# EAGLE design STM32F767ZI_eval_0 (EAGLE 7.7.0)

## Sheet 1 of 3
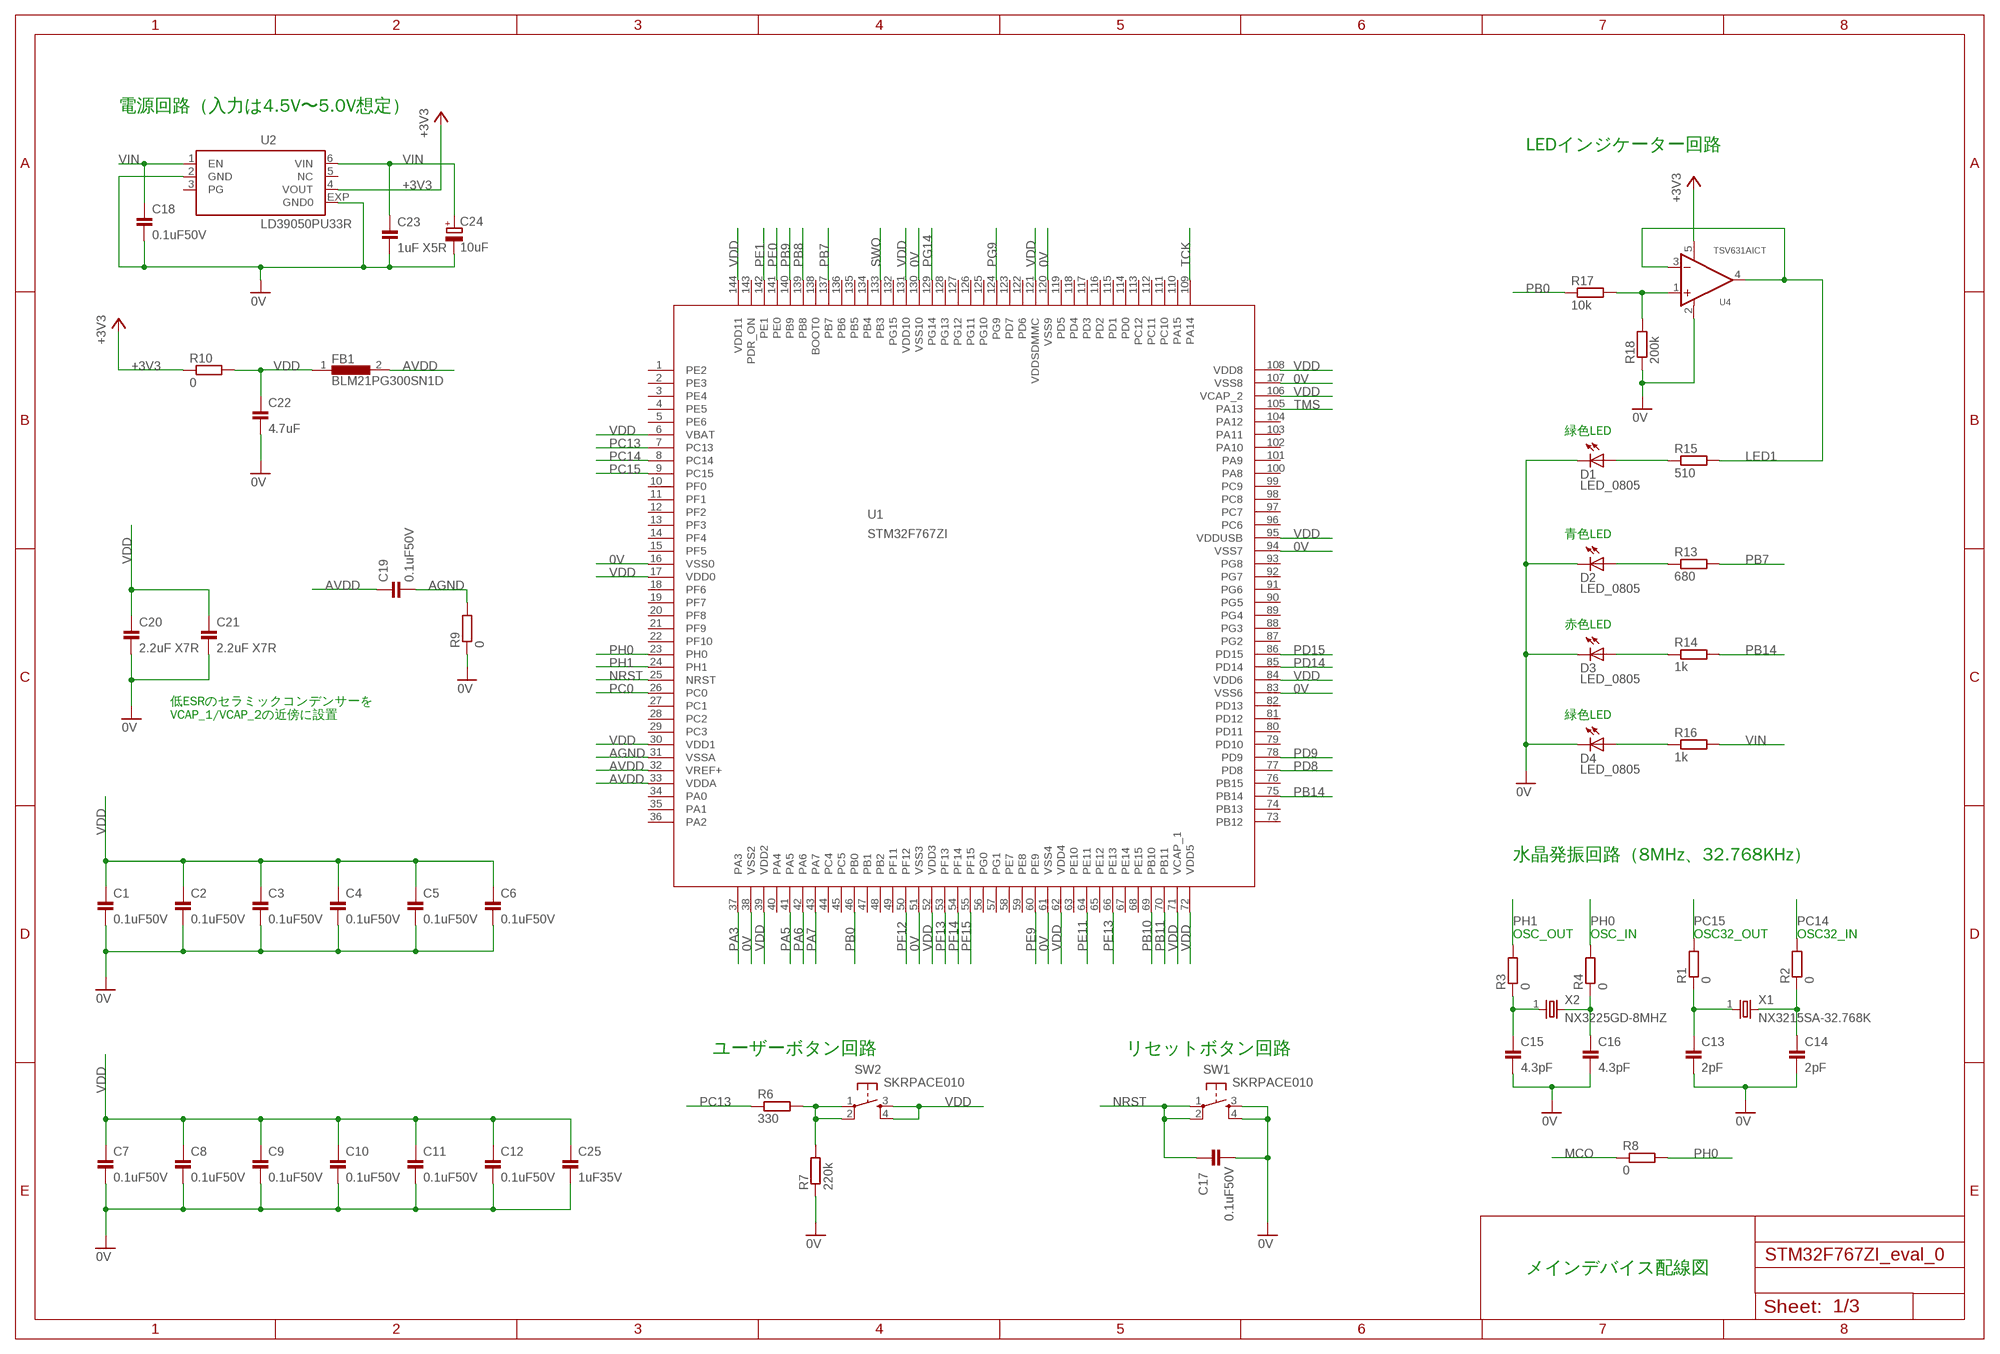
[diagram p0: schematic, sheet 1]

### Parts
C1  0.1uF50V  CAP_0603_DEV  [SMD_1608_DEV]
C2  0.1uF50V  CAP_0603_DEV  [SMD_1608_DEV]
C3  0.1uF50V  CAP_0603_DEV  [SMD_1608_DEV]
C4  0.1uF50V  CAP_0603_DEV  [SMD_1608_DEV]
C5  0.1uF50V  CAP_0603_DEV  [SMD_1608_DEV]
C6  0.1uF50V  CAP_0603_DEV  [SMD_1608_DEV]
C7  0.1uF50V  CAP_0603_DEV  [SMD_1608_DEV]
C8  0.1uF50V  CAP_0603_DEV  [SMD_1608_DEV]
C9  0.1uF50V  CAP_0603_DEV  [SMD_1608_DEV]
C10  0.1uF50V  CAP_0603_DEV  [SMD_1608_DEV]
C11  0.1uF50V  CAP_0603_DEV  [SMD_1608_DEV]
C12  0.1uF50V  CAP_0603_DEV  [SMD_1608_DEV]
C13  2pF  CAP_0603_DEV  [SMD_1608_DEV]
C14  2pF  CAP_0603_DEV  [SMD_1608_DEV]
C15  4.3pF  CAP_0603_DEV  [SMD_1608_DEV]
C16  4.3pF  CAP_0603_DEV  [SMD_1608_DEV]
C17  0.1uF50V  CAP_0603_DEV  [SMD_1608_DEV]
C18  0.1uF50V  CAP_0603_DEV  [SMD_1608_DEV]
C19  0.1uF50V  CAP_0603_DEV  [SMD_1608_DEV]
C20  2.2uF X7R  CAP_0603_DEV  [SMD_1608_DEV]
C21  2.2uF X7R  CAP_0603_DEV  [SMD_1608_DEV]
C22  4.7uF  CAP_0603_DEV  [SMD_1608_DEV]
C23  1uF X5R  CAP_0603_DEV  [SMD_1608_DEV]
C24  10uF  TPST106K016R0800_  [C1210_TPST_DEV]
C25  1uF35V  CAP_0603_DEV  [SMD_1608_DEV]
D1  LED_0805  [CHIPLED_0805]
D2  LED_0805  [CHIPLED_0805]
D3  LED_0805  [CHIPLED_0805]
D4  LED_0805  [CHIPLED_0805]
FB1  BLM21PG300SN1D  [SMD_2012_DEV]
R1  0  RESISTOR_0603_DEV  [SMD_1608_DEV]
R2  0  RESISTOR_0603_DEV  [SMD_1608_DEV]
R3  0  RESISTOR_0603_DEV  [SMD_1608_DEV]
R4  0  RESISTOR_0603_DEV  [SMD_1608_DEV]
R6  330  RESISTOR_0603_DEV  [SMD_1608_DEV]
R7  220k  RESISTOR_0603_DEV  [SMD_1608_DEV]
R8  0  RESISTOR_0603_DEV  [SMD_1608_DEV]
R9  0  RESISTOR_0603_DEV  [SMD_1608_DEV]
R10  0  RESISTOR_0603_DEV  [SMD_1608_DEV]
R13  680  RESISTOR_0603_DEV  [SMD_1608_DEV]
R14  1k  RESISTOR_0603_DEV  [SMD_1608_DEV]
R15  510  RESISTOR_0603_DEV  [SMD_1608_DEV]
R16  1k  RESISTOR_0603_DEV  [SMD_1608_DEV]
R17  10k  RESISTOR_0603_DEV  [SMD_1608_DEV]
R18  200k  RESISTOR_0603_DEV  [SMD_1608_DEV]
SW1  SKRPACE010  [SKRPACE010]
SW2  SKRPACE010  [SKRPACE010]
U1  STM32F767ZI  [LQFP144]
U2  LD39050PU33R  [DFN6-3X3]
U4  TSV631AICT  [SC-70-5]
X1  NX3215SA-32.768K  [NX3215]
X2  NX3225GD-8MHZ  [NX3225]

### Nets
0V: C1.2 C2.2 C3.2 C4.2 C5.2 C6.2 C7.2 C8.2 C9.2 C10.2 C11.2 C12.2 C13.2 C14.2 C15.2 C16.2 C17.2 C18.2 C20.2 C21.2 C22.2 C23.2 C24.2(-) C25.2 D1.C D2.C D3.C D4.C R7.1 R9.1 R18.1 SW1.3(S) SW1.4(S1) U1.16(VSS0) U1.38(VSS2) U1.51(VSS3) U1.61(VSS4) U1.83(VSS6) U1.94(VSS7) U1.107(VSS8) U1.120(VSS9) U1.130(VSS10) U2.2(GND) U2.EXP(GND0) U4.2(V-) ; also sheet 2,3
+3V3: R10.1 U2.4(VOUT) U4.5(V+) ; also sheet 2
AGND: C19.2 R9.2 U1.31(VSSA) ; also sheet 2
AVDD: C19.1 FB1.2 U1.32(VREF+) U1.33(VDDA) ; also sheet 2
LED1: R15.2 U4.3(IN-) U4.4(OUT)
MCO: R8.1
N$1: C15.1 R3.1 X2.1
N$2: C14.1 R2.1 X1.2
N$3: C13.1 R1.1 X1.1
N$4: D2.A R13.1
N$5: C16.1 R4.1 X2.2
N$6: R6.2 R7.2 SW2.1(P) SW2.2(P1)
N$7: D3.A R14.1
N$9: R17.2 R18.2 U4.1(IN+)
N$10: D1.A R15.1
N$11: D4.A R16.1
NRST: C17.1 SW1.1(P) SW1.2(P1) U1.25(NRST) ; also sheet 2,3
PA3: U1.37(PA3) ; also sheet 2
PA5: U1.41(PA5) ; also sheet 2
PA6: U1.42(PA6) ; also sheet 2
PA7: U1.43(PA7) ; also sheet 2
PB0: R17.1 U1.46(PB0)
PB7: R13.2 U1.137(PB7)
PB8: U1.139(PB8) ; also sheet 2
PB9: U1.140(PB9) ; also sheet 2
PB10: U1.69(PB10) ; also sheet 3
PB11: U1.70(PB11) ; also sheet 3
PB14: R14.2 U1.75(PB14)
PC0: U1.26(PC0) ; also sheet 2
PC13: R6.1 U1.7(PC13)
PC14: R2.2 U1.8(PC14)
PC15: R1.2 U1.9(PC15)
PD8: U1.77(PD8) ; also sheet 2
PD9: U1.78(PD9) ; also sheet 2
PD14: U1.85(PD14) ; also sheet 2
PD15: U1.86(PD15) ; also sheet 2
PE0: U1.141(PE0)
PE1: U1.142(PE1)
PE9: U1.60(PE9) ; also sheet 2
PE11: U1.64(PE11) ; also sheet 2
PE13: U1.66(PE13) ; also sheet 2
PF12: U1.50(PF12) ; also sheet 2
PF13: U1.53(PF13) ; also sheet 2
PF14: U1.54(PF14) ; also sheet 2
PF15: U1.55(PF15) ; also sheet 2
PG9: U1.124(PG9) ; also sheet 2
PG14: U1.129(PG14) ; also sheet 2
PH0: R4.2 R8.2 U1.23(PH0)
PH1: R3.2 U1.24(PH1)
SWO: U1.133(PB3) ; also sheet 2
TCK: U1.109(PA14) ; also sheet 2
TMS: U1.105(PA13) ; also sheet 2
VDD: C1.1 C2.1 C3.1 C4.1 C5.1 C6.1 C7.1 C8.1 C9.1 C10.1 C11.1 C12.1 C20.1 C21.1 C22.1 C25.1 FB1.1 R10.2 SW2.3(S) SW2.4(S1) U1.6(VBAT) U1.17(VDD0) U1.30(VDD1) U1.39(VDD2) U1.52(VDD3) U1.62(VDD4) U1.71(VCAP_1) U1.72(VDD5) U1.84(VDD6) U1.95(VDDUSB) U1.106(VCAP_2) U1.108(VDD8) U1.121(VDDSDMMC) U1.131(VDD10) U1.144(VDD11) ; also sheet 2,3
VIN: C18.1 C23.1 C24.1(+) R16.2 U2.1(EN) U2.6(VIN) ; also sheet 2
Unconnected: U1.1(PE2) U1.2(PE3) U1.3(PE4) U1.4(PE5) U1.5(PE6) U1.10(PF0) U1.11(PF1) U1.12(PF2) U1.13(PF3) U1.14(PF4) U1.15(PF5) U1.18(PF6) U1.19(PF7) U1.20(PF8) U1.21(PF9) U1.22(PF10) U1.27(PC1) U1.28(PC2) U1.29(PC3) U1.34(PA0) U1.35(PA1) U1.36(PA2) U1.40(PA4) U1.44(PC4) U1.45(PC5) U1.47(PB1) U1.48(PB2) U1.49(PF11) U1.56(PG0) U1.57(PG1) U1.58(PE7) U1.59(PE8) U1.63(PE10) U1.65(PE12) U1.67(PE14) U1.68(PE15) U1.73(PB12) U1.74(PB13) U1.76(PB15) U1.79(PD10) U1.80(PD11) U1.81(PD12) U1.82(PD13) U1.87(PG2) U1.88(PG3) U1.89(PG4) U1.90(PG5) U1.91(PG6) U1.92(PG7) U1.93(PG8) U1.96(PC6) U1.97(PC7) U1.98(PC8) U1.99(PC9) U1.100(PA8) U1.101(PA9) U1.102(PA10) U1.103(PA11) U1.104(PA12) U1.110(PA15) U1.111(PC10) U1.112(PC11) U1.113(PC12) U1.114(PD0) U1.115(PD1) U1.116(PD2) U1.117(PD3) U1.118(PD4) U1.119(PD5) U1.122(PD6) U1.123(PD7) U1.125(PG10) U1.126(PG11) U1.127(PG12) U1.128(PG13) U1.132(PG15) U1.134(PB4) U1.135(PB5) U1.136(PB6) U1.138(BOOT0) U1.143(PDR_ON) U2.3(PG) U2.5(NC)

### Notes on the sheet
- 電源回路（入力は4.5V〜5.0V想定）
- LEDインジケーター回路
- 緑色LED
- 青色LED
- 赤色LED
- 低ESRのセラミックコンデンサーを
  VCAP_1/VCAP_2の近傍に設置
- 緑色LED
- 水晶発振回路（8MHz、32.768KHz）
- OSC_OUT | OSC_IN | OSC32_OUT | OSC32_IN
- ユーザーボタン回路 | リセットボタン回路
- メインデバイス配線図

## Sheet 2 of 3
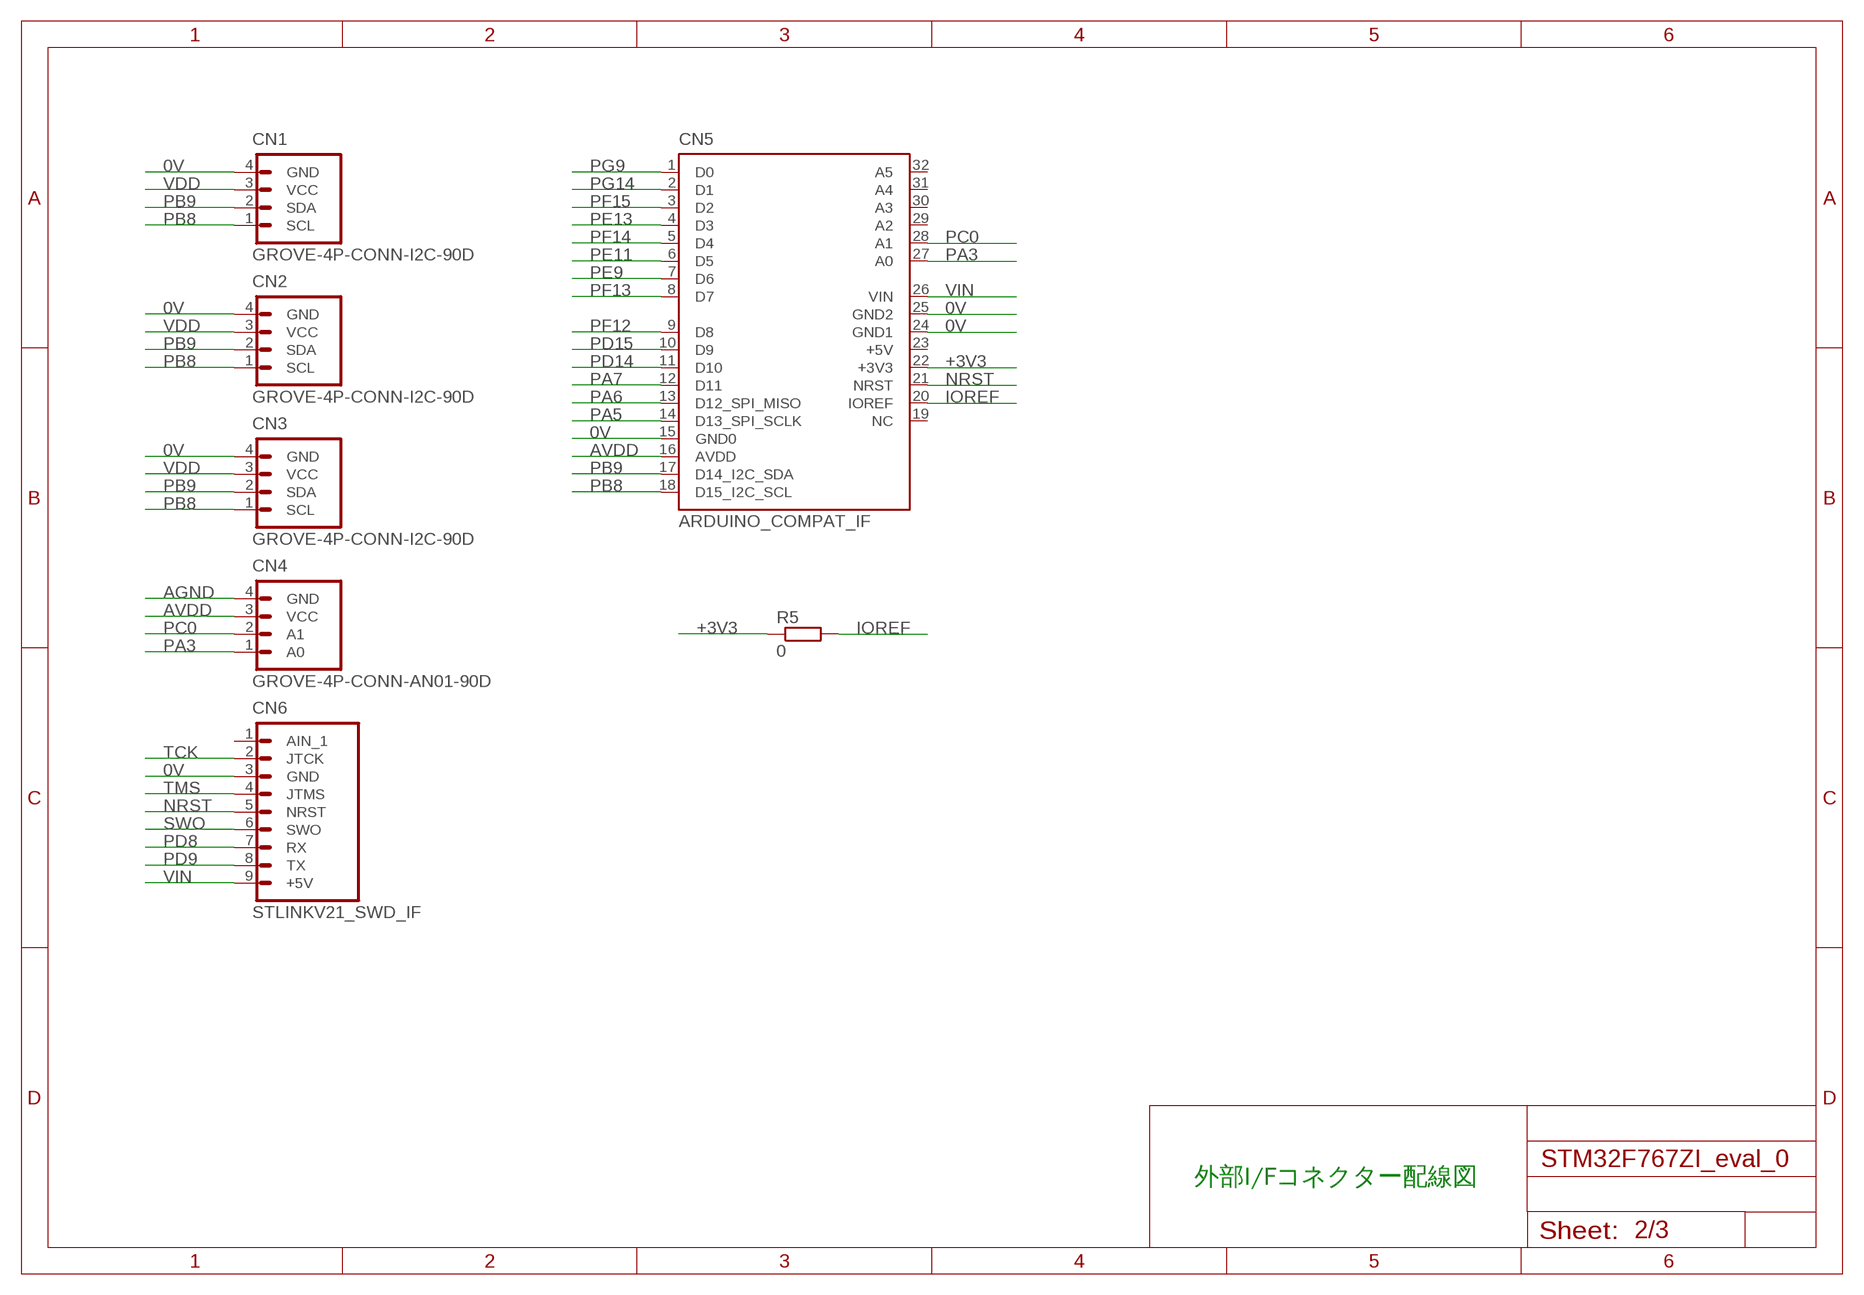
[diagram p1: schematic, sheet 2]

### Parts
CN1  GROVE-4P-CONN-I2C-90D  [GROVE-4P-90D]
CN2  GROVE-4P-CONN-I2C-90D  [GROVE-4P-90D]
CN3  GROVE-4P-CONN-I2C-90D  [GROVE-4P-90D]
CN4  GROVE-4P-CONN-AN01-90D  [GROVE-4P-90D]
CN5  ARDUINO_COMPAT_IF  [ARDUINO_COMPAT_IF]
CN6  STLINKV21_SWD_IF  [STLINKV21_SWD_H6]
R5  0  RESISTOR_0603_DEV  [SMD_1608_DEV]

### Nets
0V: CN1.4(GND) CN2.4(GND) CN3.4(GND) CN5.15(GND0) CN5.24(GND1) CN5.25(GND2) CN6.3(GND) ; also sheet 1,3
+3V3: CN5.22(+3V3) R5.1 ; also sheet 1
AGND: CN4.4(GND) ; also sheet 1
AVDD: CN4.3(VCC) CN5.16(AVDD) ; also sheet 1
IOREF: CN5.20(IOREF) R5.2
NRST: CN5.21(NRST) CN6.5(NRST) ; also sheet 1,3
PA3: CN4.1(A0) CN5.27(A0) ; also sheet 1
PA5: CN5.14(D13_SPI_SCLK) ; also sheet 1
PA6: CN5.13(D12_SPI_MISO) ; also sheet 1
PA7: CN5.12(D11) ; also sheet 1
PB8: CN1.1(SCL) CN2.1(SCL) CN3.1(SCL) CN5.18(D15_I2C_SCL) ; also sheet 1
PB9: CN1.2(SDA) CN2.2(SDA) CN3.2(SDA) CN5.17(D14_I2C_SDA) ; also sheet 1
PC0: CN4.2(A1) CN5.28(A1) ; also sheet 1
PD8: CN6.7(RX) ; also sheet 1
PD9: CN6.8(TX) ; also sheet 1
PD14: CN5.11(D10) ; also sheet 1
PD15: CN5.10(D9) ; also sheet 1
PE9: CN5.7(D6) ; also sheet 1
PE11: CN5.6(D5) ; also sheet 1
PE13: CN5.4(D3) ; also sheet 1
PF12: CN5.9(D8) ; also sheet 1
PF13: CN5.8(D7) ; also sheet 1
PF14: CN5.5(D4) ; also sheet 1
PF15: CN5.3(D2) ; also sheet 1
PG9: CN5.1(D0) ; also sheet 1
PG14: CN5.2(D1) ; also sheet 1
SWO: CN6.6(SWO) ; also sheet 1
TCK: CN6.2(JTCK) ; also sheet 1
TMS: CN6.4(JTMS) ; also sheet 1
VDD: CN1.3(VCC) CN2.3(VCC) CN3.3(VCC) ; also sheet 1,3
VIN: CN5.26(VIN) CN6.9(+5V) ; also sheet 1
Unconnected: CN5.19(NC) CN5.23(+5V) CN5.29(A2) CN5.30(A3) CN5.31(A4) CN5.32(A5) CN6.1(AIN_1)

### Notes on the sheet
- 外部I/Fコネクター配線図

## Sheet 3 of 3
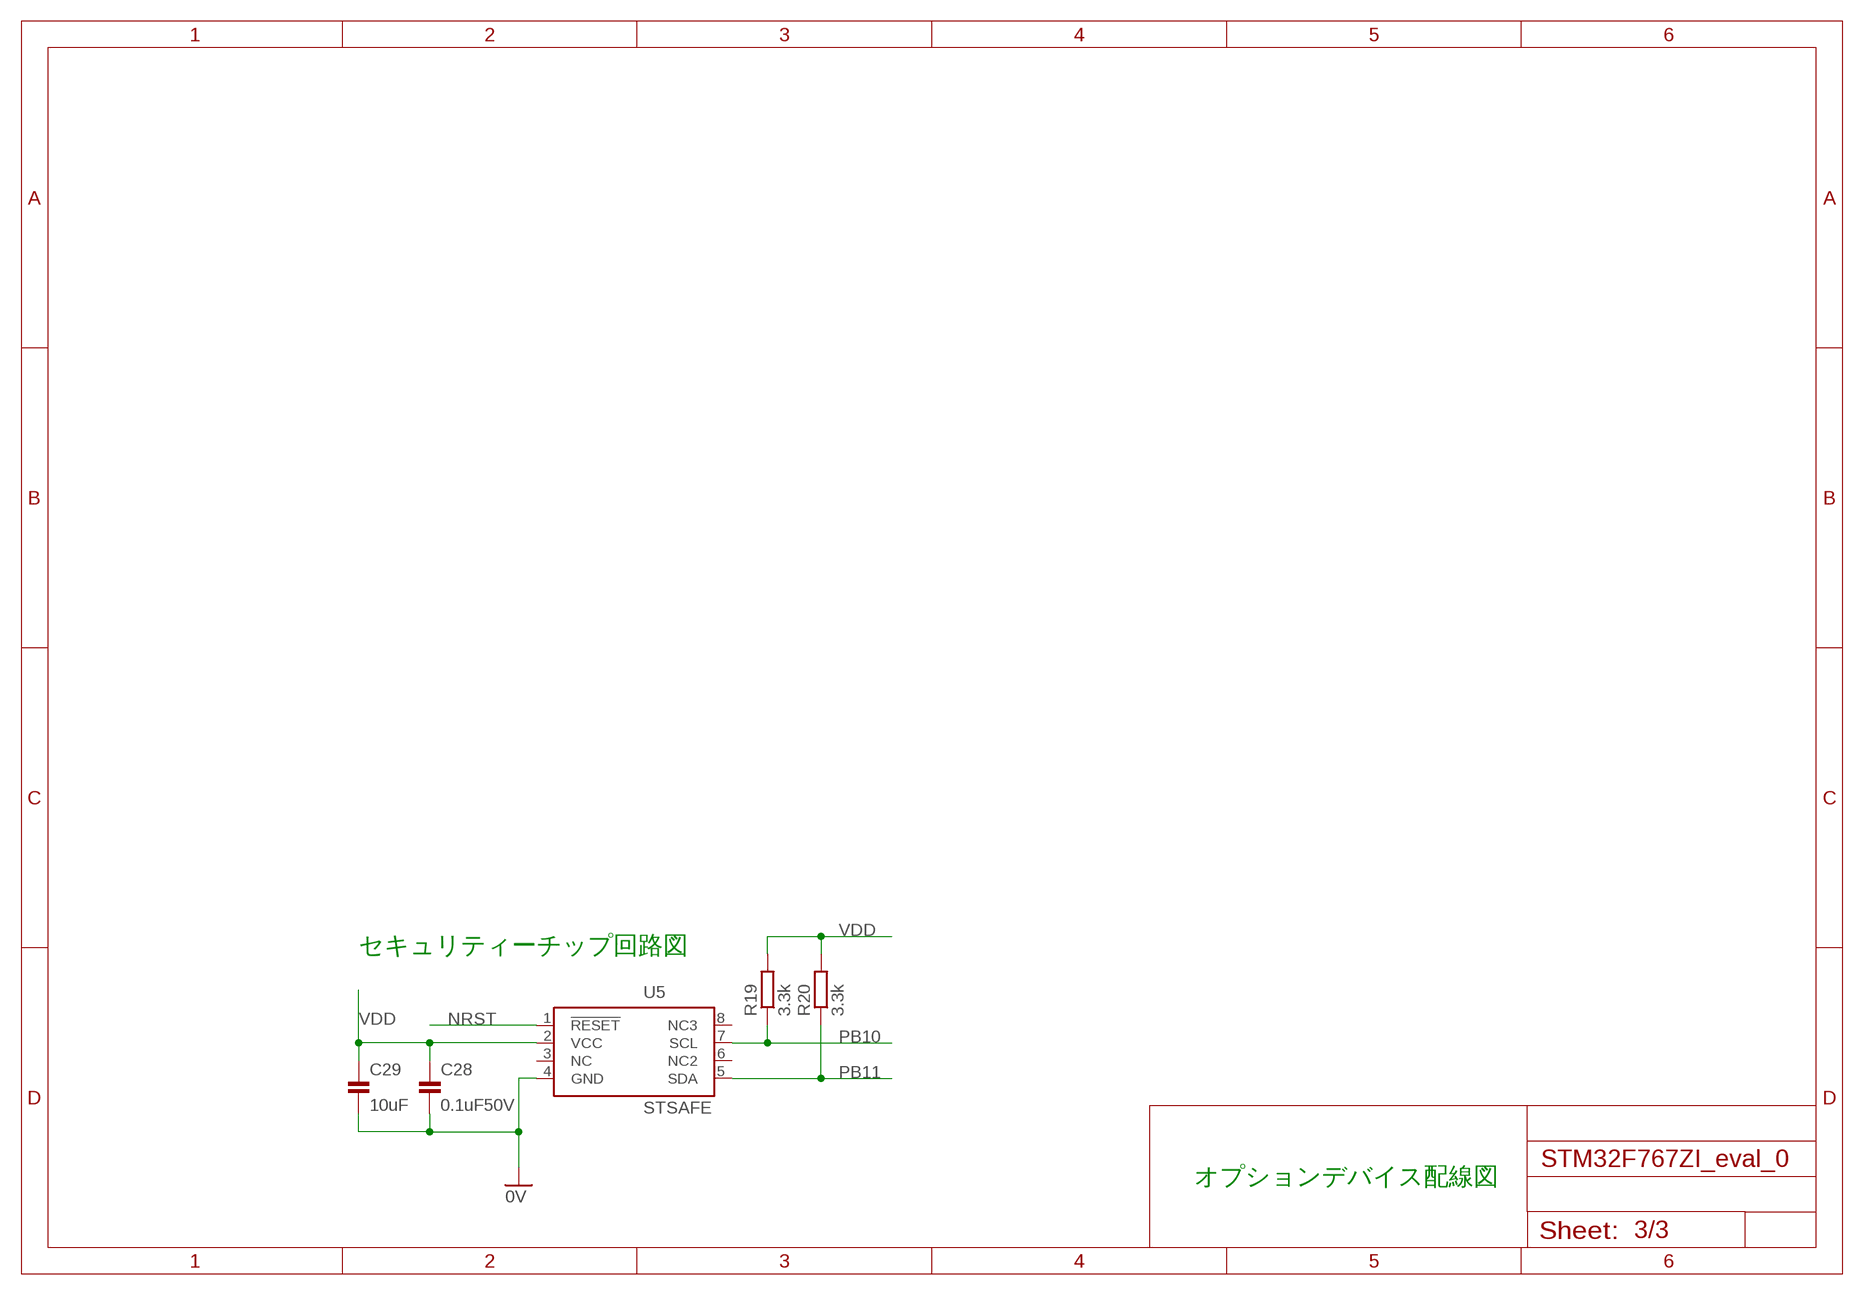
[diagram p2: schematic, sheet 3]

### Parts
C28  0.1uF50V  CAP_0603_DEV  [SMD_1608_DEV]
C29  10uF  CAP_0805_DEV  [SMD_2012_DEV]
R19  3.3k  RESISTOR_0603_DEV  [SMD_1608_DEV]
R20  3.3k  RESISTOR_0603_DEV  [SMD_1608_DEV]
U5  STSAFE  [SO8]

### Nets
0V: C28.2 C29.2 U5.4(GND) ; also sheet 1,2
NRST: U5.1(!RESET!) ; also sheet 1,2
PB10: R19.1 U5.7(SCL) ; also sheet 1
PB11: R20.1 U5.5(SDA) ; also sheet 1
VDD: C28.1 C29.1 R19.2 R20.2 U5.2(VCC) ; also sheet 1,2
Unconnected: U5.3(NC) U5.6(NC2) U5.8(NC3)

### Notes on the sheet
- セキュリティーチップ回路図
- オプションデバイス配線図

## Library data of the parts
C1-C23 C25 C28 C29 = Parts:CAP: コンデンサー
C24 = Parts:TPST*: タンタルコンデンサ TPST106K016R0800 10µF ±10% 16V ESR（等価直列抵抗）: 0.8オーム 動作温度 : -55°C～125°C サイズ : 3.50mm x 2.80mm
CN1-CN3 = PartsForProto:GROVE-4P-CONN-I2C: GROVE 4ピンコネクタ（I2C）
CN4 = PartsForProto:GROVE-4P-CONN-AN01: GROVE 4ピンコネクタ（ANALOG A0/A1）
CN5 = PartsForProto:ARDUINO_COMPAT_IF: Arduino互換ピンインターフェース
CN6 = PartsForProto:STLINKV21_SWD_IF: ST-LINK V2-1用 SWDインターフェース #1-#6は、NUCLEO-F767ZI付属のST-LINK V2-1上のCN6と接続 #7,#8は、NUCLEO-F767ZI付属のST-LINK V2-1上のCN5と接続 #9は、+5Vを別途供給（またはNUCLEOのJP3と接続）
D1-D4 = Parts:LED: 発光ダイオード
FB1 = Parts:BLM21PG: フェライトビーズ EMIFIL® 周波数あたりのインピーダンス : 30オーム @ 100MHz 電流定格（最大） : 4A DC抵抗（DCR）（最大）: 14ミリオーム 動作温度 : -55°C～125°C
R1-R10 R13-R20 = Parts:RESISTOR: 抵抗器
SW1 SW2 = Parts:SKRPACE010: 表面実装用タクトスイッチ ４．２×３．２ｍｍ小型重作動力タイプ ・作動力：２．５５Ｎ ・操作方向：垂直 ・移動量：０．２ｍｍ ・動作寿命：５０，０００ｃｙｃｌｅｓ （５ｍＡ ５ＶＤＣ） ・初期接触抵抗：最大５００ｍΩ
U1 = Parts:STM32F767ZI: Arm Cortex-M7 32b MCU+FPU
U2 = Parts:LD39050PU33R: LDO電圧レギュレータ 出力電圧: 3.3 V 出力電流: 500 mA 入力電圧最大値: 5.5 V 最小入力電圧: + 1.5 V 出力タイプ: Fixed 最低動作温度: - 40 C 最高動作温度: + 125 C
U4 = Parts:TSV631AICT: オペレーショナル・アンプ 出力電流 (各チャンネル): 63 mA GBP - ゲイン帯域幅製品: 880 kHz 動作供給電圧: 1.5 V to 5.5 V Vos - 入力オフセット電圧: 500 uV 動作供給電流: 60 uA 最高動作温度: + 125 C 最低動作温度: - 40 C
U5 = Parts:STSAFE
X1 = Parts:NX3215SA: 水晶振動子 周波数 32.768kHz 周波数公差 ±20ppm 負荷容量 6pF ESR（等価直列抵抗） 70 kOhms 動作温度 -40°C～85°C
X2 = Parts:NX3225GD: 水晶振動子 周波数 8MHz 周波数安定性 ±150ppm 周波数公差 ±50ppm 負荷容量 8pF ESR（等価直列抵抗） 500 Ohms 動作温度 -40°C～150°C 定格 AEC-Q200

## Board
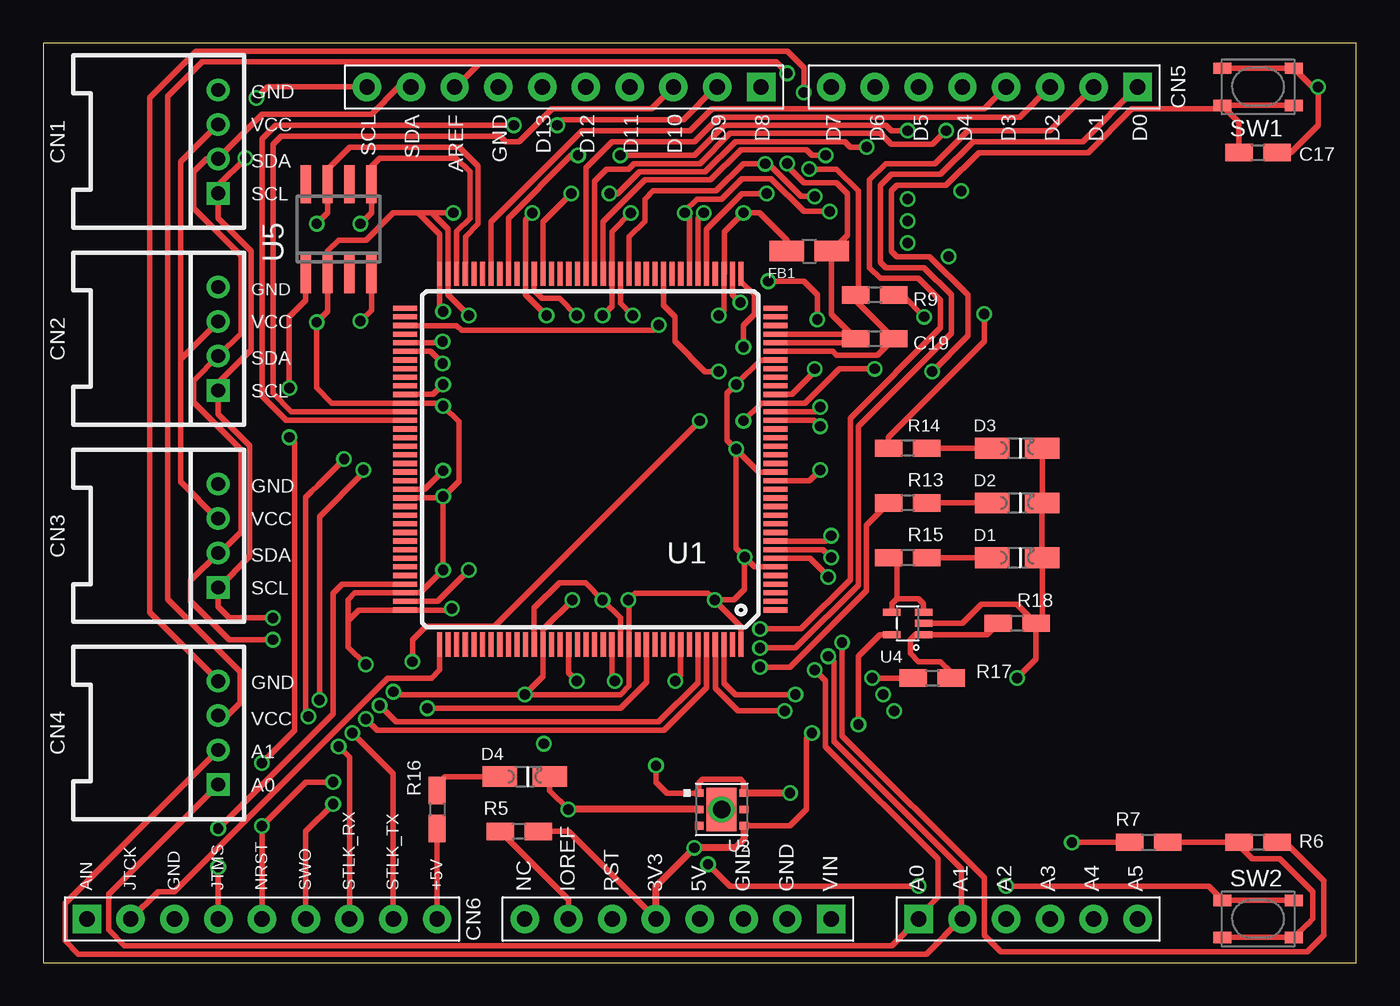
[diagram p3: board, top side]
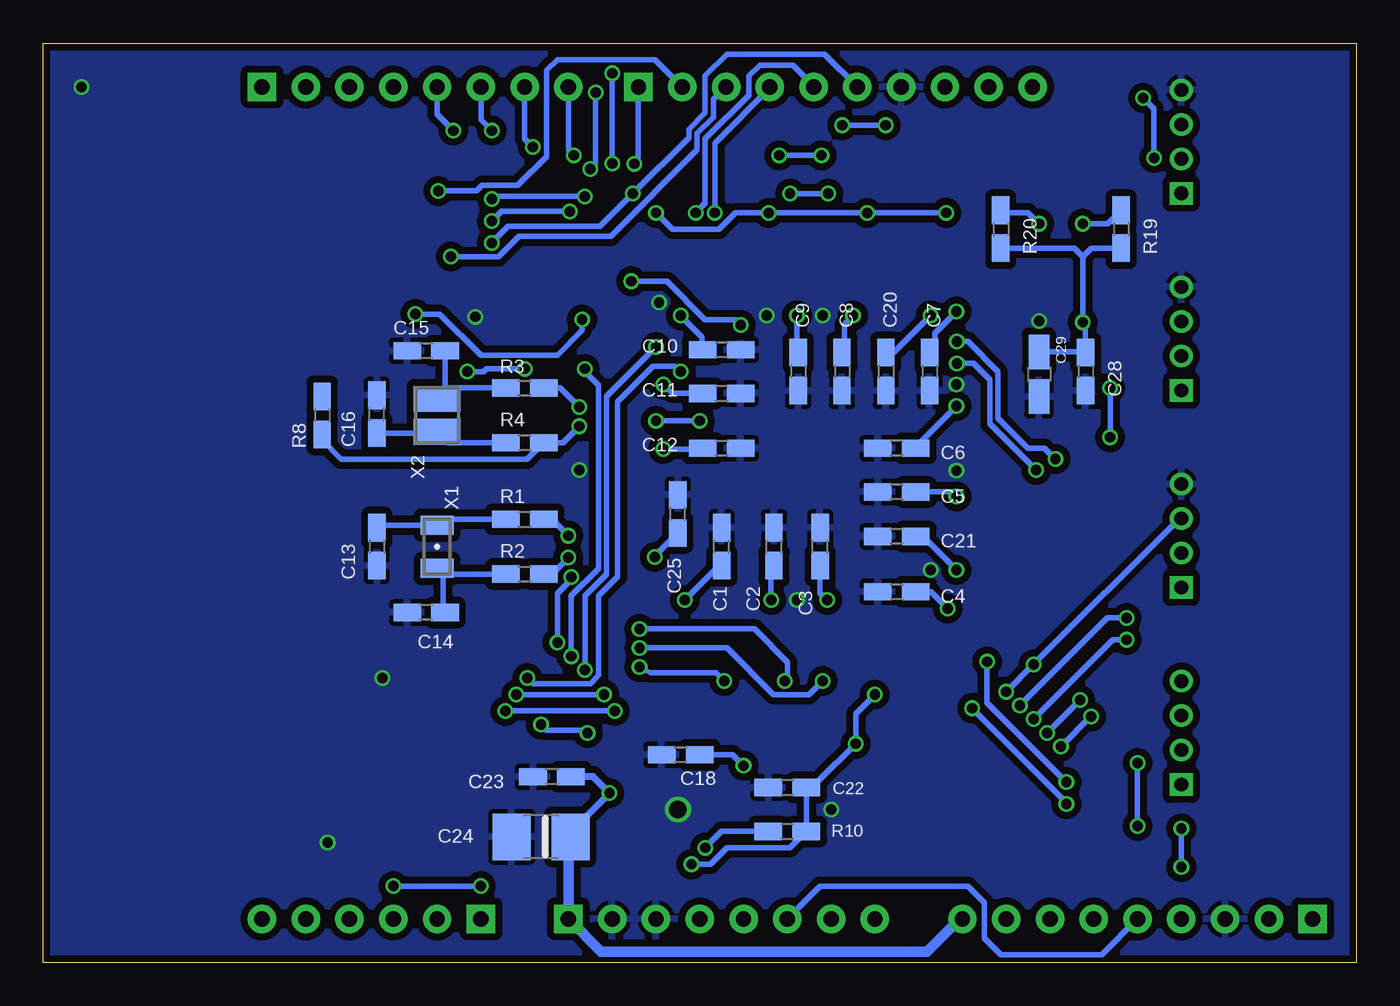
[diagram p4: board, bottom side, seen from below]

Size 76.2 x 53.34 mm. Coordinates in mm from the lower left corner, seen from the top.
Outline: 0,0 76.2,0 76.2,53.34 0,53.34 0,0
Copper layers (1*16): Top 0.035mm / dielectric 1.5mm / Bottom 0.035mm
Design rules "SeeedStudio_2layer_DRU_no_angle_20140221": minimum track width 6mil, minimum drill 12mil, track to track 6mil, track to pad 6mil, pad to pad 6mil, via to via 6mil, smd to smd 0mil, copper to edge 10mil, drill to drill 10mil, minimum pad ring 10mil, minimum via ring 6mil, stop-mask expansion 2mil, vias tented up to drill 100mil, thermal gap 10mil

### Footprints (pad centres in the part's own frame; a part is rotated, then mirrored left to right if it is on the bottom)
SMD_1608_DEV = smd 1.6 x 1: 1 -1.1,0; 2 1.1,0
C1210_TPST_DEV = smd 2.2 x 2.7: 1 -1.7,0; 2 1.7,0
SMD_2012_DEV = smd 2 x 1.2: 1 -1.3,0; 2 1.3,0
GROVE-4P-90D = drill 0.8 pad 1.27 square: 1 -3,0 | drill 0.8 pad 1.27: 2 -1,0; 3 1,0; 4 3,0
ARDUINO_COMPAT_IF = drill 0.889 pad 1.651 square: 1 63.5,50.8; 9 41.656,50.8; 26 45.72,2.54; 27 50.8,2.54 | drill 0.889 pad 1.651: 2 60.96,50.8; 3 58.42,50.8; 4 55.88,50.8; 5 53.34,50.8; 6 50.8,50.8; 7 48.26,50.8; 8 45.72,50.8; 10 39.116,50.8; 11 36.576,50.8; 12 34.036,50.8; 13 31.496,50.8; 14 28.956,50.8; 15 26.416,50.8; 16 23.876,50.8; 17 21.336,50.8; 18 18.796,50.8; 19 27.94,2.54; 20 30.48,2.54; 21 33.02,2.54; 22 35.56,2.54; 23 38.1,2.54; 24 40.64,2.54; 25 43.18,2.54; 28 53.34,2.54; 29 55.88,2.54; 30 58.42,2.54; 31 60.96,2.54; 32 63.5,2.54
STLINKV21_SWD_H6 = drill 0.889 pad 1.651 square: 1 0,0 | drill 0.889 pad 1.651: 2 2.54,0; 3 5.08,0; 4 7.62,0; 5 10.16,0; 6 12.7,0; 7 15.24,0; 8 17.78,0; 9 20.32,0
CHIPLED_0805 = smd 2 x 1.2: A -1.45,0; C 1.45,0
SKRPACE010 = smd 1.05 x 0.65: 1 -2.075,1.075; 2 2.075,1.075; 3 -2.075,-1.075; 4 2.075,-1.075
LQFP144 = smd 1.4 x 0.3: 1 -10.75,8.75; 2 -10.75,8.25; 3 -10.75,7.75; 4 -10.75,7.25; 5 -10.75,6.75; 6 -10.75,6.25; 7 -10.75,5.75; 8 -10.75,5.25; 9 -10.75,4.75; 10 -10.75,4.25; 11 -10.75,3.75; 12 -10.75,3.25; 13 -10.75,2.75; 14 -10.75,2.25; 15 -10.75,1.75; 16 -10.75,1.25; 17 -10.75,0.75; 18 -10.75,0.25; 19 -10.75,-0.25; 20 -10.75,-0.75; 21 -10.75,-1.25; 22 -10.75,-1.75; 23 -10.75,-2.25; 24 -10.75,-2.75; 25 -10.75,-3.25; 26 -10.75,-3.75; 27 -10.75,-4.25; 28 -10.75,-4.75; 29 -10.75,-5.25; 30 -10.75,-5.75; 31 -10.75,-6.25; 32 -10.75,-6.75; 33 -10.75,-7.25; 34 -10.75,-7.75; 35 -10.75,-8.25; 36 -10.75,-8.75; 73 10.75,-8.75; 74 10.75,-8.25; 75 10.75,-7.75; 76 10.75,-7.25; 77 10.75,-6.75; 78 10.75,-6.25; 79 10.75,-5.75; 80 10.75,-5.25; 81 10.75,-4.75; 82 10.75,-4.25; 83 10.75,-3.75; 84 10.75,-3.25; 85 10.75,-2.75; 86 10.75,-2.25; 87 10.75,-1.75; 88 10.75,-1.25; 89 10.75,-0.75; 90 10.75,-0.25; 91 10.75,0.25; 92 10.75,0.75; 93 10.75,1.25; 94 10.75,1.75; 95 10.75,2.25; 96 10.75,2.75; 97 10.75,3.25; 98 10.75,3.75; 99 10.75,4.25; 100 10.75,4.75; 101 10.75,5.25; 102 10.75,5.75; 103 10.75,6.25; 104 10.75,6.75; 105 10.75,7.25; 106 10.75,7.75; 107 10.75,8.25; 108 10.75,8.75 | smd 0.3 x 1.4: 37 -8.75,-10.75; 38 -8.25,-10.75; 39 -7.75,-10.75; 40 -7.25,-10.75; 41 -6.75,-10.75; 42 -6.25,-10.75; 43 -5.75,-10.75; 44 -5.25,-10.75; 45 -4.75,-10.75; 46 -4.25,-10.75; 47 -3.75,-10.75; 48 -3.25,-10.75; 49 -2.75,-10.75; 50 -2.25,-10.75; 51 -1.75,-10.75; 52 -1.25,-10.75; 53 -0.75,-10.75; 54 -0.25,-10.75; 55 0.25,-10.75; 56 0.75,-10.75; 57 1.25,-10.75; 58 1.75,-10.75; 59 2.25,-10.75; 60 2.75,-10.75; 61 3.25,-10.75; 62 3.75,-10.75; 63 4.25,-10.75; 64 4.75,-10.75; 65 5.25,-10.75; 66 5.75,-10.75; 67 6.25,-10.75; 68 6.75,-10.75; 69 7.25,-10.75; 70 7.75,-10.75; 71 8.25,-10.75; 72 8.75,-10.75; 109 8.75,10.75; 110 8.25,10.75; 111 7.75,10.75; 112 7.25,10.75; 113 6.75,10.75; 114 6.25,10.75; 115 5.75,10.75; 116 5.25,10.75; 117 4.75,10.75; 118 4.25,10.75; 119 3.75,10.75; 120 3.25,10.75; 121 2.75,10.75; 122 2.25,10.75; 123 1.75,10.75; 124 1.25,10.75; 125 0.75,10.75; 126 0.25,10.75; 127 -0.25,10.75; 128 -0.75,10.75; 129 -1.25,10.75; 130 -1.75,10.75; 131 -2.25,10.75; 132 -2.75,10.75; 133 -3.25,10.75; 134 -3.75,10.75; 135 -4.25,10.75; 136 -4.75,10.75; 137 -5.25,10.75; 138 -5.75,10.75; 139 -6.25,10.75; 140 -6.75,10.75; 141 -7.25,10.75; 142 -7.75,10.75; 143 -8.25,10.75; 144 -8.75,10.75
DFN6-3X3 = smd 0.5 x 0.45: 1 -1.3,0.95; 2 -1.3,0; 3 -1.3,-0.95; 4 1.3,-0.95; 5 1.3,0; 6 1.3,0.95 | smd 1.75 x 2.5: EXP 0,0
SC-70-5 = smd 0.4 x 1: 1 -0.65,-0.925; 2 0,-0.925; 3 0.65,-0.925; 4 0.65,0.925; 5 -0.65,0.925
SO8 = smd 0.6 x 2.2: 1 -1.905,-2.6; 2 -0.635,-2.6; 3 0.635,-2.6; 4 1.905,-2.6; 5 1.905,2.6; 6 0.635,2.6; 7 -0.635,2.6; 8 -1.905,2.6
NX3215 = smd 1.1 x 1.9: 1 -1.25,0; 2 1.25,0
NX3225 = smd 1.5 x 2.7: 1 -0.95,0; 2 0.95,0

### Placement (x,y rotation side)
C1  36.83,24.13 90 bottom
C2  33.79,24.13 90 bottom
C3  31.11,24.13 90 bottom
C4  26.67,21.52 180 bottom
C5  26.67,27.3 180 bottom
C6  26.67,29.84 180 bottom
C7  24.77,34.29 270 bottom
C8  29.84,34.29 270 bottom
C9  32.38,34.29 270 bottom
C10  36.83,35.56 0 bottom
C11  36.83,33.02 0 bottom
C12  36.83,29.84 0 bottom
C13  56.83,24.13 270 bottom
C14  53.98,20.32 180 bottom
C15  53.98,35.49 180 bottom
C16  56.83,31.82 90 bottom
C17  70.48,46.99 0 top
C18  39.21,12.06 180 bottom
C19  48.26,36.2 0 top
C20  27.3,34.29 270 bottom
C21  26.67,24.73 180 bottom
C22  33.02,10.16 180 bottom
C23  46.67,10.79 180 bottom
C24  47.31,7.3 180 bottom
C25  39.37,26.04 90 bottom
C28  15.72,34.29 270 bottom
C29  18.41,34.13 270 bottom
CN1  10.16,47.62 90 top
CN2  10.16,36.2 90 top
CN3  10.16,24.77 90 top
CN4  10.16,13.34 90 top
CN5  0,0 0 top
CN6  2.54,2.54 0 top
D1  56.52,23.5 0 top
D2  56.52,26.67 0 top
D3  56.52,29.84 0 top
D4  27.94,10.79 0 top
FB1  44.45,41.27 0 top
R1  48.26,25.72 0 bottom
R2  48.26,22.54 0 bottom
R3  48.26,33.34 0 bottom
R4  48.26,30.16 0 bottom
R5  27.62,7.62 180 top
R6  70.48,6.99 180 top
R7  64.14,6.99 0 top
R8  60.01,31.75 270 bottom
R9  48.26,38.73 180 top
R10  33.02,7.62 0 bottom
R13  50.16,26.67 180 top
R14  50.16,29.84 180 top
R15  50.16,23.5 180 top
R16  22.86,8.89 270 top
R17  51.59,16.51 0 top
R18  56.52,19.68 180 top
R19  13.65,42.55 270 bottom
R20  20.64,42.55 270 bottom
SW1  70.48,50.8 180 top
SW2  70.48,2.54 180 top
U1  31.75,29.21 180 top
U2  39.37,8.89 0 top
U4  50.16,19.68 90 top
U5  17.14,42.55 0 top
X1  53.34,24.13 270 bottom
X2  53.34,31.75 270 bottom

### Tracks (layer width: path | path; a pad name or v marks a point on that pad's centre or on a via)
0V  (via drill 0.6, 1 pad 1.42)
  Top 0.305: U1.51 33.5,38.25 v34.21,37.54 | U1.38 40,38.75 v40.46,38.29 | U1.130 33.5,20 v32.46,21.04 31.46,22.04 29.96,22.04 28.5,20.58 U1.120 | U1.94 22.13,27.46 v23.21,28.54 | U1.83 22.63,32.96 v23.21,33.54 | U1.107 22.88,20.96 v24.71,22.79 | U1.61 28.5,39 28.96,38.54 29.96,38.54 v30.96,37.54 | R9.1 49.85,38.73 v51.12,37.47 | SW1.4 SW1.3 73.64,50.8 v73.98,50.8 73.98,48.58 72.39,46.99 C17.2 | U1.16 44.47,27.96 v45.09,28.57 | R7.1 v59.69,6.99 | R18.1 57.62,17.61 v56.52,16.51 | U4.2 53.34,19.68 54.45,20.8 56.5,20.8 R18.1 | U5.4 19.05,37.85 v18.42,37.22 | R18.1 57.97,20.04 D1.C 57.94,23.52 57.94,26.65 D2.C D3.C | D4.C 29.39,9.98 v30.48,8.89
  Top 0.406: U2.2 v30.48,8.89
  Bottom 0.61: C24.2 49.53,8.26
  other vias: 39.37,8.89
  pour Bottom (isolate 0.406, rank 6): -1.27,54.61 77.47,54.61 77.47,-1.27 -1.27,-1.27
+3V3  (via drill 0.6)
  Top 0.305: R5.1 30.48,7.62 CN5.22 | U4.5 48.56,19.04 47.31,17.78 v47.31,13.81 | v44.61,13.34 44.29,13.02 44.29,8.89 43.34,7.94 U2.4
  Top 0.406: U2.4 40.67,7.17 40.16,6.67 v37.78,6.67 35.56,4.45 CN5.22
  Bottom 0.305: 34.12,7.45 R10.1 36.83,7.62 v37.78,6.67 | v47.31,13.81 46.99,13.49 44.77,13.49 v44.61,13.34
AGND  (via drill 0.6)
  Top 0.305: v44.13,50.48 44.13,51.91 43.18,52.86 8.89,52.86 6.19,50.16 6.19,20.32 CN4.4 | U1.31 45.82,35.46 46.04,35.24 48.41,35.24 C19.2 47.16,38.4 R9.2 47.31,38.88 47.31,44.77 46.04,46.04 v44.45,46.04
  Bottom 0.305: CN4.4 | v44.13,50.48 44.13,46.35 v44.45,46.04
AVDD  (via drill 0.6)
  Top 0.305: 25.4,52.25 9.23,52.25 7.23,50.25 7.23,21.07 11.43,16.88 11.43,15.08 10.68,14.34 CN4.3 | 25.4,52.25 42.52,52.25 v43.18,51.59 | CN5.16 23.95,50.8 25.4,52.25 | C19.1 45.75,37.6 FB1.2 46.67,42.2 46.67,44.61 46.04,45.24 44.13,45.24 43.18,46.2 v43.18,46.35 | U1.33 46.9,36.46 C19.1 | U1.32 46.92,35.96 C19.1
  Bottom 0.305: v43.18,51.59 v43.18,46.35
IOREF
  Top 0.305: CN5.20 30.48,3.66 R5.2
LED1
  Top 0.305: U4.3 51.09,20.82 50.8,21.11 49.53,21.11 | U4.4 49.24,20.82 49.53,21.11 | R15.2 49.21,23.5 49.53,23.18 49.53,21.11
N$1
  Bottom 0.305: R3.1 52.7,33.34 X2.1 52.88,33.16 C15.1
N$2
  Bottom 0.305: R2.1 53,22.54 | 53,22.54 X1.2 | 53,22.54 53,20.45 C14.1
N$3
  Bottom 0.305: R1.1 53,25.72 X1.1 56.68,25.38 C13.1
N$4
  Top 0.305: R13.1 D2.A
N$5
  Bottom 0.305: R4.1 52.7,30.16 X2.2 53.42,30.72 C16.1
N$6
  Top 0.305: SW2.2 SW2.1 73.34,2.25 73.37,2.25 73.66,2.54 73.66,4.13 71.75,6.03 70.17,6.03 69.39,6.82 R6.2 | R6.2 69.39,7.33 | R6.2 69.39,7.13 | R7.2 R6.2
N$7
  Top 0.305: R14.1 D3.A
N$9
  Top 0.305: R18.2 54.77,19.04 U4.1 51.08,19.05 50.64,19.05 50.32,18.73 50.32,17.94 50.8,17.46 52.07,17.46 52.69,16.84 R17.2
N$10
  Top 0.305: R15.1 D1.A
N$11
  Top 0.305: R16.1 22.86,10.32 23.34,10.79 D4.A
NRST  (via drill 0.6)
  Top 0.305: SW1.1 SW1.2 68.22,49.53 | 68.22,49.53 63.18,49.53 60.64,46.99 54.29,46.99 52.39,45.09 49.53,45.09 49.21,44.77 49.21,41.27 49.53,40.96 51.44,40.96 53.66,38.73 53.66,36.35 v51.59,34.29 | v14.29,33.34 14.29,37.47 15.24,38.42 U5.1 | CN6.5 v12.7,7.94 15.24,10.48 v16.83,10.48 | v12.7,11.59 14.61,13.49 14.61,30.16 v14.29,30.48 | 68.22,49.53 68.58,49.53 69.37,48.74 69.37,47 C17.1 | v40.64,31.43 41.67,32.46 U1.25 44.21,32.46 46.2,34.45 v48.26,34.45 | v21.43,17.46 21.43,18.73 22.23,19.53 26.19,19.53 v38.1,31.43
  Bottom 0.305: v14.29,33.34 v14.29,30.48 | CN6.5 14.76,0.48 20.64,0.48 21.59,1.43 21.59,3.49 22.54,4.45 31.11,4.45 CN5.21 | v12.7,7.94 v12.7,11.59 | v16.83,10.48 21.43,15.08 v21.43,17.46 | v51.59,34.29 50.64,34.29 50.48,34.45 v48.26,34.45 | v38.1,31.43 v40.64,31.43
PA3  (via drill 0.6)
  Top 0.305: U1.37 40.5,39.51 41.27,38.73 41.27,37.62 40.64,36.99 v40.64,35.72 | CN4.1 3.81,3.98 3.81,1.91 4.71,1 49.26,1 CN5.27 50.8,2.7 51.91,3.81 51.91,6.03 45.4,12.54 45.4,16.35 v44.77,16.99
  Bottom 0.305: v40.64,35.72 43.5,32.86 43.5,22.54 44.77,21.27 v44.77,16.99
PA5  (via drill 0.6)
  Top 0.305: U1.41 38.5,42.55 40.56,44.61 v41.99,44.61
  Bottom 0.305: CN5.14 30.86,52.7 36.51,52.7 37.78,51.44 37.78,49.29 38.73,48.34 38.73,47.86 v41.99,44.61 43.89,42.7 49.21,42.7 v50.16,41.75
PA6  (via drill 0.6)
  Top 0.305: U1.42 38,43.16 v38.34,43.5
  Bottom 0.305: CN5.13 31.5,50.86 32.7,52.07 34.61,52.07 35.24,51.44 35.24,50.32 37.78,47.78 37.78,44.05 v38.34,43.5
PA7  (via drill 0.6)
  Top 0.305: U1.43 37.5,43.22 v37.23,43.5 37.23,43.58 37.94,44.29 39.37,44.29 40.56,45.48 42.23,45.48 44.13,43.58 v45.64,43.58
  Bottom 0.305: CN5.12 34.04,50.74 37.23,47.55 v37.23,43.5 | v50.16,43.02 49.61,43.58 v45.64,43.58
PB0  (via drill 0.6)
  Top 0.305: v48.1,16.51 R17.1 | U1.46 36,38.14 36.67,37.47 36.67,36.04 38.42,34.29 v39.21,34.29
  Bottom 0.305: v48.1,16.51 47.78,16.19 44.45,16.19 43.97,16.67 43.97,21.27 42.86,22.38 42.86,32.54 40.8,34.61 39.53,34.61 v39.21,34.29
PB7  (via drill 0.6)
  Top 0.305: U1.137 36.99,18.45 36.99,16.67 v36.67,16.35 | R13.2 47.78,25.39 47.78,21.59 43.34,17.14 v41.59,17.14
  Bottom 0.305: v41.59,17.14 40.96,16.83 37.15,16.83 v36.67,16.35
PB8  (via drill 0.6)
  Top 0.305: CN1.1 10.18,44.62 | v13.34,20 10.79,20 10.16,20.64 CN3.1 10.18,21.77 11.98,23.57 11.98,30 10.16,31.82 CN2.1 10.16,33.66 12.06,35.56 12.06,41.27 10.16,43.18 CN1.1 | U1.139 38,16.25 35.72,13.97 20.48,13.97 v19.53,14.92 | CN1.1 10.16,45.09 v11.75,46.67 | v12.38,50.16 13.02,50.8 CN5.18
  Bottom 0.305: v13.34,20 14.45,20 v19.53,14.92 | v11.75,46.67 11.75,49.53 v12.38,50.16
PB9  (via drill 0.6)
  Top 0.305: v13.34,18.73 10.79,18.73 8.57,20.95 8.57,22.18 CN3.2 10.24,23.77 11.48,25 11.48,29.75 8.73,32.5 8.73,33.77 CN2.2 11.48,36.52 11.48,41 8.73,43.75 8.73,45.88 9.48,46.62 CN1.2 10.16,46.67 12.7,49.21 19.05,49.21 20.64,50.8 CN5.17 | U1.140 38.5,15.96 36.04,13.49 19.37,13.49 v18.73,14.13
  Bottom 0.305: v18.73,14.13 14.13,18.73 v13.34,18.73
PB10  (via drill 0.6)
  Top 0.305: v15.88,42.86 16.51,43.5 U5.7 16.51,46.04 17.78,47.31 24.13,47.31 25.24,46.2 25.24,42.86 24.5,42.12 U1.69
  Bottom 0.305: v15.88,42.86 14.44,42.86 R19.1
PB11  (via drill 0.6)
  Top 0.305: v18.41,42.86 19.05,43.5 U5.5 19.05,46.2 19.53,46.67 23.97,46.67 24.77,45.88 24.77,43.18 24,42.41 U1.70
  Bottom 0.305: v18.41,42.86 19.05,43.5 20.49,43.5 R20.1
PB14  (via drill 0.6)
  Top 0.305: U1.75 24,36.96 24.29,36.67 35.4,36.67 v35.72,36.99 | v54.61,37.62 54.61,36.04 49.05,30.48 49.05,29.86 R14.2 | v42.07,39.53 44.13,39.53 44.93,38.73 v44.93,37.31
  Bottom 0.305: v35.72,36.99 36.04,37.31 37.78,37.31 40.01,39.53 v42.07,39.53 | v54.61,37.62 53.18,37.62 50.8,35.24 46.35,35.24 44.93,36.67 v44.93,37.31
PC0  (via drill 0.6)
  Top 0.305: CN5.28 53.29,2.54 | 53.29,2.54 51.25,0.5 2.04,0.5 1.27,1.27 1.27,3.44 CN4.2 | v44.77,34.45 44.77,34.29 43.44,32.96 U1.26 | v45.56,17.78 45.88,17.46 45.88,12.86 53.29,5.45 53.29,2.54
  Bottom 0.305: v44.77,34.45 44.77,34.29 43.97,33.5 43.97,22.86 45.56,21.27 v45.56,17.78
PC13  (via drill 0.6)
  Top 0.305: R6.1 72.07,6.99 74.3,4.76 74.3,1.59 73.34,0.64 55.56,0.64 54.61,1.59 54.61,4.92 46.35,13.18 v46.35,18.57 | U1.7 44.48,23.46 v45.56,22.38
  Bottom 0.305: v46.35,18.57 46.35,21.43 45.56,22.23 v45.56,22.38
PC14  (via drill 0.6)
  Top 0.305: U1.8 45.26,23.96 v45.72,23.5
  Bottom 0.305: v45.72,23.5 46.67,22.54 R2.2
PC15  (via drill 0.6)
  Top 0.305: U1.9 45.41,24.46 v45.72,24.77
  Bottom 0.305: v45.72,24.77 46.67,25.72 R1.2
PD8  (via drill 0.6)
  Top 0.305: U1.77 23.1,35.96 v23.18,36.04 | v17.46,29.21 15.95,27.7 15.56,27.3 15.24,26.99 15.24,14.45 v15.4,14.29 | CN6.7 17.78,11.91 v17.14,12.54
  Bottom 0.305: v23.18,36.04 22.54,36.04 20.8,34.29 20.8,31.59 19.05,29.84 18.1,29.84 v17.46,29.21 | v15.4,14.29 v17.14,12.54
PD9  (via drill 0.6)
  Top 0.305: U1.78 22.48,35.46 v23.18,34.77 | v18.57,28.57 18.57,28.42 16.03,25.88 v16.03,15.24 | CN6.8 20.32,10.95 v17.94,13.34
  Bottom 0.305: v23.18,34.77 22.23,34.77 21.27,33.81 21.27,31.27 v18.57,28.57 | v16.03,15.24 v17.94,13.34
PD14  (via drill 0.6)
  Top 0.305: U1.85 14.39,31.96 13.34,33.02 13.34,47.47 13.81,47.94 26.51,47.94 26.83,47.62 27.62,47.62 29.53,49.53 35.31,49.53 CN5.11
  Bottom 0.305: v52.55,40.96 49.77,40.96 48.58,42.15 43.26,42.15 38.26,47.15 38.26,48.1 37.31,49.05 37.31,50.07 CN5.11
PD15  (via drill 0.6)
  Top 0.305: U1.86 14.1,31.46 12.7,32.86 12.7,47.78 13.49,48.58 v27.3,48.58 | CN5.10 39.05,50.8 37.15,48.9 30.16,48.9 v29.84,48.58
  Bottom 0.305: v27.3,48.58 v29.84,48.58 | v53.26,44.77 51.04,44.77 50.72,45.09 48.66,45.09 46.99,46.75 46.99,51.75 46.35,52.39 40.7,52.39 CN5.10
PE0  (via drill 0.6)
  Top 0.305: U1.141 39,15.93 40.32,14.61 v43.02,14.61
  Bottom 0.305: v49.37,14.61 v43.02,14.61
PE1  (via drill 0.6)
  Top 0.305: U1.142 39.5,16.22 40.16,15.56 v43.66,15.56
  Bottom 0.305: v48.74,15.56 v43.66,15.56
PE9  (via drill 0.6)
  Top 0.305: U1.60 29,42.97 v30.64,44.61 | v32.86,44.61 33.34,44.61 34.61,45.88 38.42,45.88 40.16,47.62 46.51,47.62 46.83,47.31 v47.78,47.31
  Bottom 0.305: v32.86,44.61 v30.64,44.61 | CN5.7 48.26,47.78 v47.78,47.31
PE11  (via drill 0.6)
  Top 0.305: v33.5,46.83 37.78,46.83 39.53,48.58 48.9,48.58 49.21,48.26 v50.16,48.26 | U1.64 27,43.19 30.64,46.83 v31.04,46.83
  Bottom 0.305: v31.04,46.83 v33.5,46.83 | CN5.6 50.8,48.9 v50.16,48.26
PE13
  Top 0.305: CN5.4 54.61,49.53 38.81,49.53 37.54,48.26 31.27,48.26 26,42.99 U1.66
PF12  (via drill 0.6)
  Top 0.305: U1.50 34,42.1 34.92,43.02 34.92,44.29 35.4,44.77 39.05,44.77 40.62,46.34 v41.89,46.34 42.09,46.34 43.97,44.45 v44.77,44.45
  Bottom 0.305: v44.77,44.45 50.01,44.45 v50.16,44.29 | v41.89,46.34 41.85,46.34 41.67,46.51 41.67,50.78 CN5.9
PF13  (via drill 0.6)
  Top 0.305: U1.53 32.5,42.98 34.92,45.4 38.73,45.4 40.48,47.15 44.29,47.15 44.61,46.83 v45.4,46.83
  Bottom 0.305: CN5.8 45.72,47.15 v45.4,46.83
PF14  (via drill 0.6)
  Top 0.305: U1.54 32,45.34 32.7,46.04 33.97,46.04 34.29,46.35 38.1,46.35 39.85,48.1 48.58,48.1 49.21,47.47 51.59,47.47 v52.39,48.26
  Bottom 0.305: CN5.5 53.34,49.21 v52.39,48.26
PF15
  Top 0.305: U1.55 31.5,46.1 33.02,47.62 37.78,47.62 39.21,49.05 56.67,49.05 CN5.3
PG9  (via drill 0.6)
  Top 0.305: U1.124 30.5,16.81 v30.96,16.35 | CN5.1 60.33,47.62 53.98,47.62 52.07,45.72 49.21,45.72 48.58,45.09 48.58,40.64 48.9,40.32 51.12,40.32 52.7,38.73 52.7,36.51 47.31,31.11 47.31,21.91 43.66,18.26 v41.59,18.26
  Bottom 0.305: v30.96,16.35 31.75,15.56 33.81,15.56 36.51,18.26 v41.59,18.26
PG14  (via drill 0.6)
  Top 0.305: CN5.2 58.42,48.26 53.66,48.26 51.75,46.35 48.9,46.35 47.94,45.4 47.94,40.32 48.58,39.69 50.8,39.69 52.07,38.42 52.07,36.83 46.83,31.59 46.83,22.23 43.97,19.37 v41.59,19.37 | U1.129 33,16.53 v33.18,16.35
  Bottom 0.305: v33.18,16.35 33,16.53 33,17.44 34.92,19.37 v41.59,19.37
PH0  (via drill 0.6)
  Top 0.305: U1.23 44.74,31.46 v45.09,31.11
  Bottom 0.305: v45.09,31.11 46.04,30.16 R4.2 48.11,29.21 58.9,29.21 60.01,30.32 R8.2
PH1  (via drill 0.6)
  Top 0.305: U1.24 44.82,31.96 v45.09,32.23
  Bottom 0.305: R3.2 46.2,33.34 v45.09,32.23
SWO  (via drill 0.6)
  Top 0.305: U1.133 35,16.27 33.5,14.76 v22.3,14.76 | CN6.6 15.24,7.62 v16.83,9.21
  Bottom 0.305: v16.83,9.21 16.83,9.29 v22.3,14.76
TCK
  Top 0.305: U1.109 23.02,18.44 23.02,16.99 22.54,16.51 20,16.51 7.62,4.13 6.67,4.13 CN6.2
TMS  (via drill 0.6)
  Top 0.305: CN6.4 v10.16,5.56 | U1.105 17.36,21.96 16.83,21.43 16.83,14.45 v10.16,7.78
  Bottom 0.305: v10.16,5.56 v10.16,7.78
VDD  (via drill 0.6)
  Top 0.305: U1.144 40.5,19.5 v38.96,21.04 | v30.71,21.04 29,19.33 U1.121 29,16.62 v27.94,15.56 | U1.6 41.29,22.96 v40.71,23.54 | U1.17 41.54,28.46 v40.21,29.79 | U1.30 41.63,34.96 v40.21,33.54 | v39.21,37.54 39.5,37.83 U1.39 39.53,39.99 39.53,42.39 v40.64,43.5 41.56,43.5 43.15,41.91 FB1.1 | v29.21,37.54 28,38.75 U1.62 28,43.1 v28.39,43.49 | v32.46,37.54 33,38.08 U1.52 33,42.4 v34.09,43.49 | v24.71,37.54 23.5,38.75 U1.71 23.5,42.54 22.54,43.5 | U1.95 23.13,26.96 v23.21,27.04 | v23.71,20.54 23.63,20.46 U1.108 18.31,20.46 17.69,19.84 | 7.98,35 7.98,46.45 CN1.3 | CN2.3 10.16,37.18 7.98,35 | 17.69,19.84 17.69,21.06 18.09,21.46 U1.106 21.88,21.46 v23.21,22.79 v23.21,27.04 | 17.69,19.84 17.69,18.31 18.7,17.3 v18.73,17.3 | v38.96,21.04 v38.96,21.05 40.1,21.05 40.71,21.66 v40.71,23.54 | v40.21,29.79 40.21,24.04 v40.71,23.54 | v23.21,27.04 23.23,27.04 24.13,27.94 24.13,31.37 v23.21,32.29 23.04,32.46 U1.84 16.75,32.46 15.88,33.34 v15.88,37.15 16.51,37.78 U5.2 16.51,41.29 17.13,41.91 18.73,41.91 20.32,43.5 21.75,43.5 | SW2.3 SW2.4 68.41,3.66 67.63,4.45 v55.88,4.45 | CN3.3 10.11,25.77 7.98,27.9 7.98,35 | v50.8,4.45 39.85,4.45 v38.58,5.71 | v23.21,37.77 23,37.98 U1.72 23,42.25 21.75,43.5 | 40.16,33.59 v40.21,33.54 | v23.81,43.5 22.54,43.5 | 21.75,43.5 22.54,43.5 | v40.21,33.54 39.69,33.02 39.69,30.31 v40.21,29.79 | v38.96,21.04 38.57,21.43 34.35,21.43 v33.96,21.04 34,21 U1.131 34,16.06 33.5,15.56 v27.94,15.56 | v27.94,15.56 20.48,15.56 v20.32,15.72
  Bottom 0.305: v40.71,23.54 40.71,23.59 C25.1 | v40.21,29.79 37.98,29.79 C12.1 | C11.1 37.95,33.04 39.71,33.04 v40.21,33.54 | C10.1 37.96,35.59 37.96,36.29 v39.21,37.54 | v29.21,37.54 29.71,37.04 29.71,35.52 C8.1 | v32.46,37.54 32.46,35.47 C9.1 | C7.1 24.46,35.7 24.46,36.52 v23.21,37.77 | C21.1 25.14,24.73 v23.21,22.79 | CN2.3 10.16,37.15 | 23.46,27.29 v23.21,27.04 23.48,27.3 C5.1 | 15.88,40.96 v15.88,37.15 15.72,36.99 C28.1 15.76,35.43 C29.1 | v20.32,15.72 v18.73,17.3 10.27,25.77 CN3.3 | v50.8,4.45 v55.88,4.45 | 31.92,10.49 C22.1 R10.2 32.87,6.67 36.51,6.67 37.47,5.71 v38.58,5.71 | v23.81,43.5 29.34,43.5 v28.39,43.49 v34.09,43.49 34.42,43.5 36.04,43.5 36.99,42.55 39.69,42.55 v40.64,43.5 | v38.96,21.04 v38.96,21.05 36.98,23.03 C1.1 | C2.1 33.79,22.57 33.97,22.38 33.97,21.05 v33.96,21.04 | 31.92,10.49 32.4,10.49 | C20.1 26.86,35.39 v24.71,37.54 | C6.1 25.56,29.94 v23.21,32.29 | C4.1 24.68,21.52 v23.71,20.54 | C3.1 31.11,21.45 v30.71,21.04 | R19.2 15.39,41.45 15.88,40.96 | R20.2 16.36,41.45 15.88,40.96 | v27.94,15.56 29.05,14.45 v29.05,12.7 31.26,10.49 31.92,10.49
  Bottom 0.406: R10.2 31.92,7.96
VIN  (via drill 0.6)
  Top 0.305: v35.56,11.43 35.56,10.48 36.2,9.84 U2.1 38.07,10.45 38.26,10.64 40.48,10.64 40.64,10.48 40.64,9.87 | CN6.9 R16.2
  Top 0.406: 40.64,9.87 U2.6 v43.34,9.84
  Bottom 0.305: v35.56,11.43 36.2,12.06 C18.1
  Bottom 0.406: 45.72,7.83 C24.1 45.61,7.57 v43.34,9.84 44.29,10.79 C23.1
  Bottom 0.61: 45.72,7.83 CN5.26 43.81,0.64 24.92,0.64 23.02,2.54 CN6.9

### Text on the board
tPlace: GND | VCC | SDA | SCL | GND | VCC | SDA | SCL | GND | VCC | SDA | SCL | GND | VCC | A1 | A0